# EAGLE design untitled (EAGLE 9.3.1)
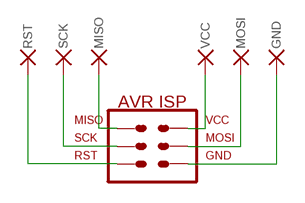
[diagram p0: schematic, sheet 1]

## Parts
GND  GND  POGO_PIN_P50-XX_HORIZONTALLY  [POGO_PIN_P50-XX_HORIZONTALLY]
MISO  MISO  POGO_PIN_P50-XX_HORIZONTALLY  [POGO_PIN_P50-XX_HORIZONTALLY]
MOSI  MOSI  POGO_PIN_P50-XX_HORIZONTALLY  [POGO_PIN_P50-XX_HORIZONTALLY]
RST  RST  POGO_PIN_P50-XX_HORIZONTALLY  [POGO_PIN_P50-XX_HORIZONTALLY]
SCK  SCK  POGO_PIN_P50-XX_HORIZONTALLY  [POGO_PIN_P50-XX_HORIZONTALLY]
VCC  VCC  POGO_PIN_P50-XX_HORIZONTALLY  [POGO_PIN_P50-XX_HORIZONTALLY]
X1  AVR-ISP_6X_IDC_LOCK_EDGE_PCB  [AVR-ISP-6_EDGE_PCB]

## Nets
GND: GND.P$1(P) X1.GND
MISO: MISO.P$1(P) X1.MISO
MOSI: MOSI.P$1(P) X1.MOSI
RST: RST.P$1(P) X1.RST
SCK: SCK.P$1(P) X1.SCK
VCC: VCC.P$1(P) X1.VCC

## Library data of the parts
GND MISO MOSI RST SCK VCC = Emsit-Connectors:POGO_PIN
X1 = Emsit-Connectors:AVR-ISP

## Board
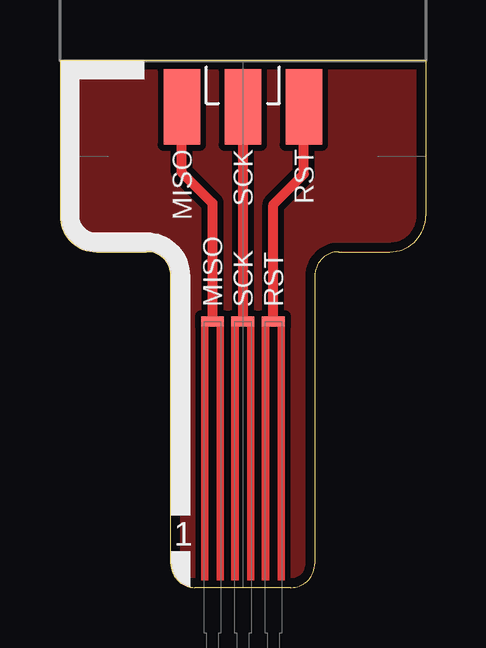
[diagram p1: board, top side]
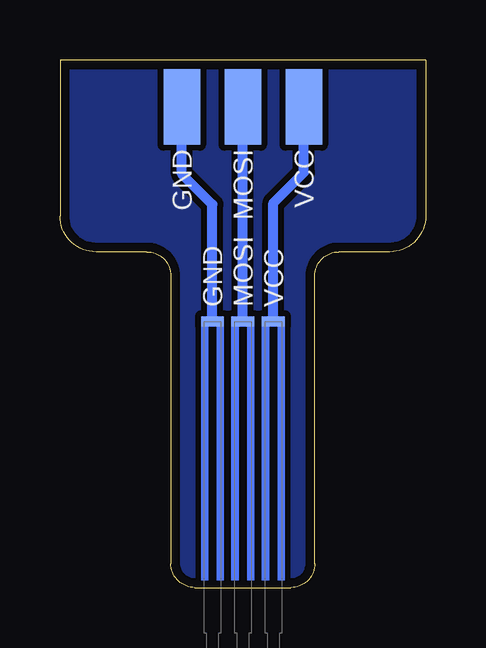
[diagram p2: board, bottom side, seen from below]

Size 15.24 x 22 mm. Coordinates in mm from the lower left corner, seen from the top.
Outline: 0,22 15.24,22 15.24,15.5 arc-90 13.74,14 11.62,14 arc90 10.62,13 10.62,1 arc-90 9.62,0 5.62,0 arc-90 4.62,1 4.62,13 arc90 3.62,14 1.5,14 arc-90 0,15.5 0,22
Copper layers (1*16): Top 0.035559375mm / dielectric 1.6mm / Bottom 0.035559375mm
Design rules "default": minimum track width 6mil, minimum drill 10mil, track to track 6mil, track to pad 6mil, pad to pad 6mil, via to via 6mil, smd to smd 6mil, copper to edge 15mil, drill to drill 6mil, minimum pad ring 5mil, minimum via ring 5mil, stop-mask expansion 2.5mil, vias tented up to drill 0.5mm, thermal gap 10mil

### Footprints (pad centres in the part's own frame; a part is rotated, then mirrored left to right if it is on the bottom)
POGO_PIN_P50-XX_HORIZONTALLY = smd 0.95 x 0.41: P$1 0,5.5
AVR-ISP-6_EDGE_PCB = smd 1.524 x 3.15 bottom: GND 2.54,-0.15; MOSI 0,-0.15; VCC -2.54,-0.15 | smd 1.524 x 3.15: MISO -2.54,-0.15; RST 2.54,-0.15; SCK 0,-0.15

### Placement (x,y rotation side)
GND  8.89,5.6 0 bottom
MISO  6.35,5.6 0 top
MOSI  7.62,5.6 0 bottom
RST  8.89,5.6 0 top
SCK  7.62,5.6 0 top
U$1  [6.00X2.53]  13.24,18 90 top
VCC  6.35,5.6 0 bottom
X1  7.62,20.18 0 top

### Tracks (layer width: path | path; a pad name or v marks a point on that pad's centre or on a via)
GND
  Bottom 0.406: GND.P$1 8.89,15.97 10.16,17.24 X1.GND
MISO
  Top 0.406: MISO.P$1 6.35,16.04 5.08,17.31 X1.MISO
MOSI
  Bottom 0.406: MOSI.P$1 X1.MOSI
N$1
  pour Top (isolate 0.254): 4.62,13 4.62,1 arc90 5.62,0 9.62,0 arc90 10.62,1 10.62,13 arc-90 11.62,14 13.74,14 arc90 15.24,15.5 15.24,22 0,22 0,15.5 arc90 1.5,14 3.62,14 arc-90
N$2
  pour Bottom (isolate 0.254): 4.62,13 4.62,1 arc90 5.62,0 9.62,0 arc90 10.62,1 10.62,13 arc-90 11.62,14 13.74,14 arc90 15.24,15.5 15.24,22 0,22 0,15.5 arc90 1.5,14 3.62,14 arc-90
RST
  Top 0.406: RST.P$1 8.89,15.97 10.16,17.24 X1.RST
SCK
  Top 0.406: X1.SCK SCK.P$1
VCC
  Bottom 0.406: VCC.P$1 6.35,16.04 5.08,17.31 X1.VCC

### Text on the board
tPlace: 1
tStop: AVR-ISP / pogo
bStop: 2x3 IDC 2.54mm / 2x3 pogo 1.27mm